# EAGLE design 7seg Display Breakboard_Rev00 (EAGLE 5.11)
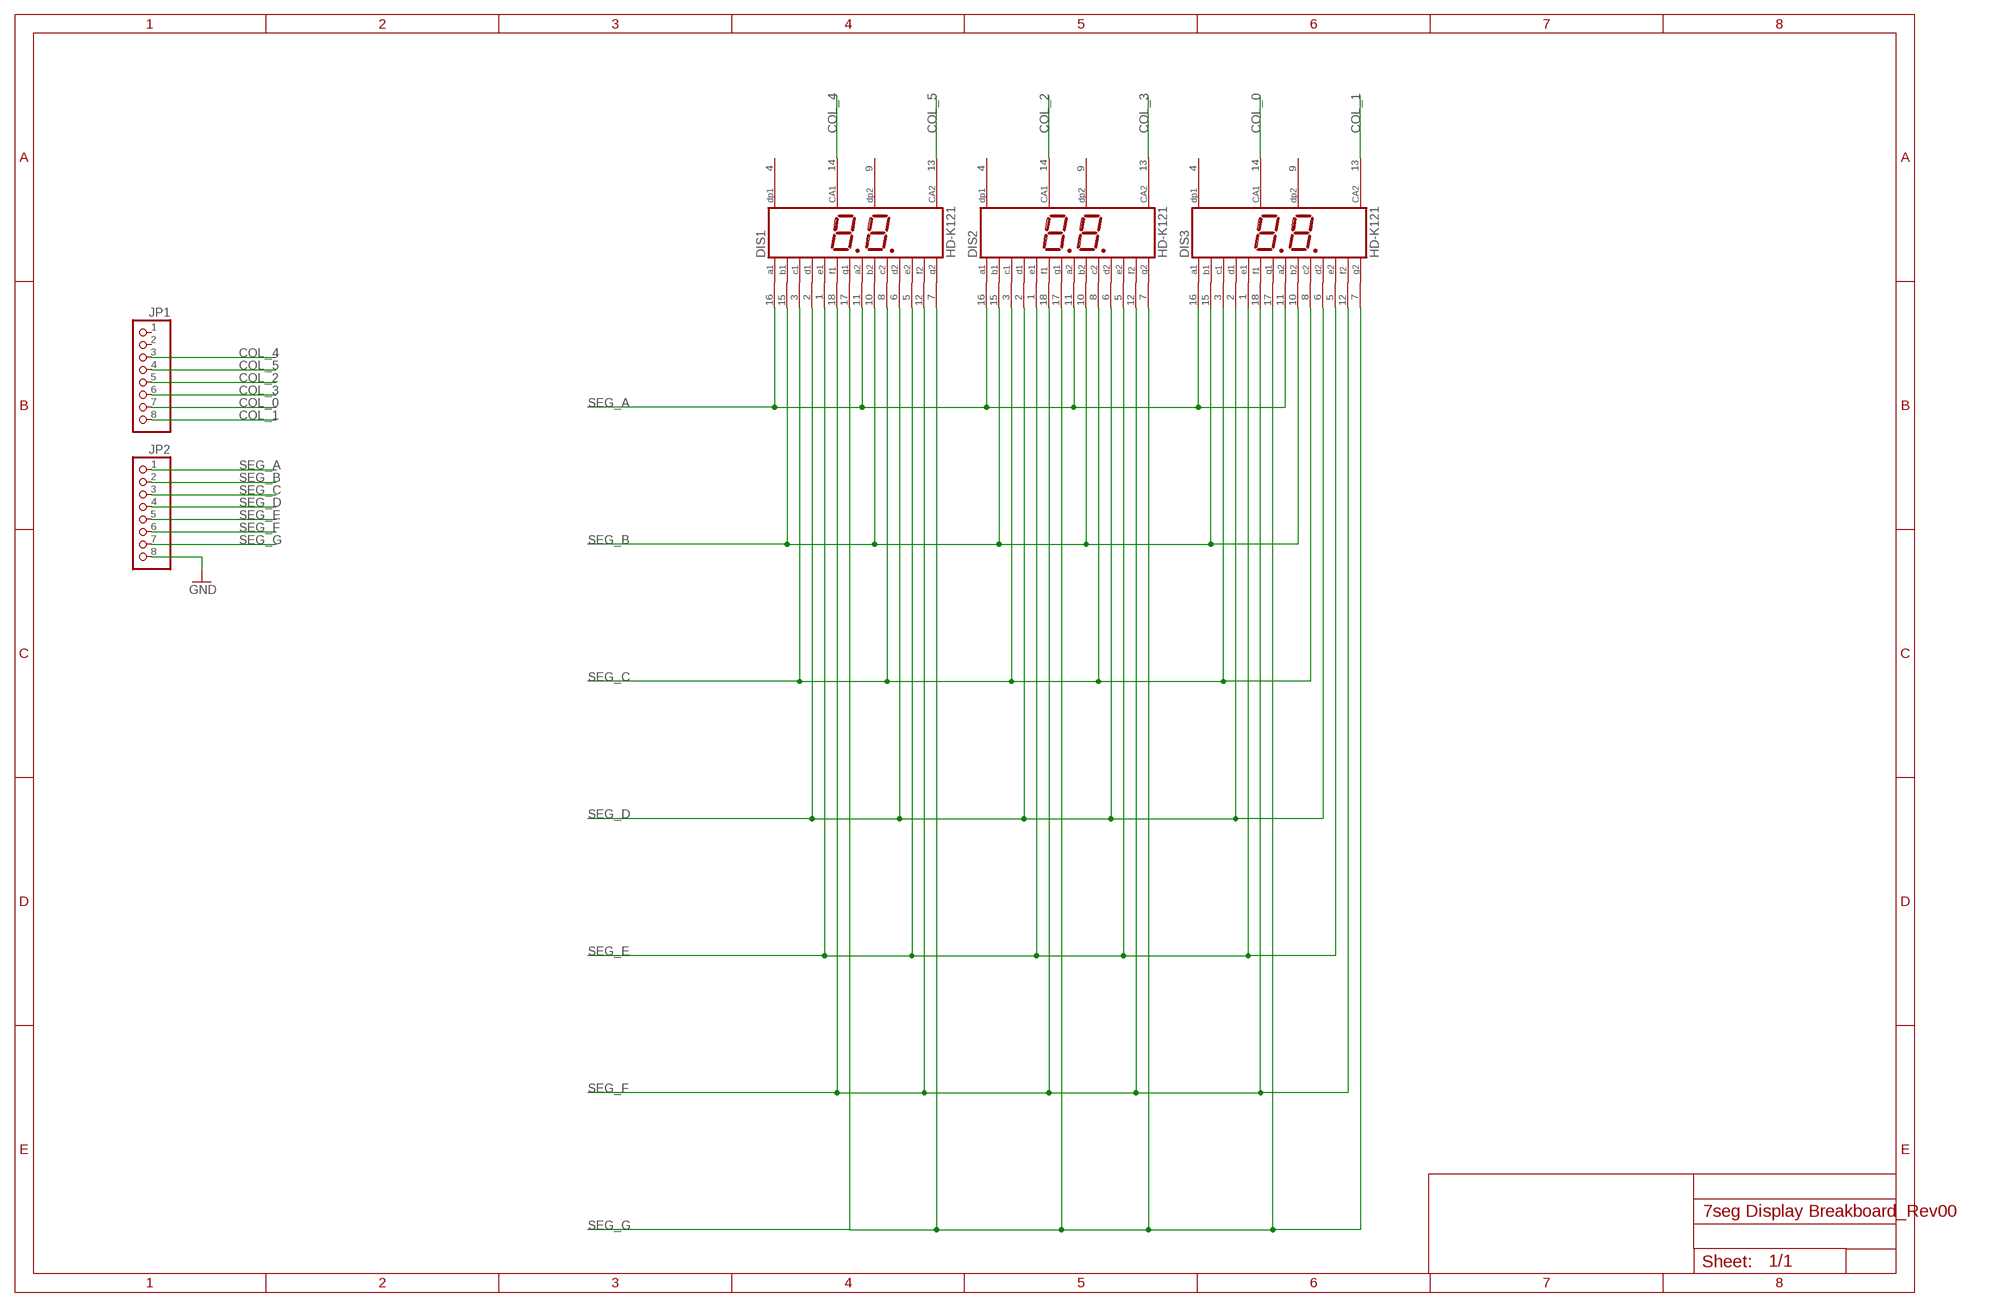
[diagram p0: schematic, sheet 1]

## Parts
DIS1  HD-K121  [HDSP-R]
DIS2  HD-K121  [HDSP-R]
DIS3  HD-K121  [HDSP-R]
JP1  PINHD-1X8/90  [1X08/90]
JP2  PINHD-1X8/90  [1X08/90]

## Nets
COL_0: DIS3.14(CA1) JP1.7
COL_1: DIS3.13(CA2) JP1.8
COL_2: DIS2.14(CA1) JP1.5
COL_3: DIS2.13(CA2) JP1.6
COL_4: DIS1.14(CA1) JP1.3
COL_5: DIS1.13(CA2) JP1.4
GND: JP2.8
SEG_A: DIS1.11(A2) DIS1.16(A1) DIS2.11(A2) DIS2.16(A1) DIS3.11(A2) DIS3.16(A1) JP2.1
SEG_B: DIS1.10(B2) DIS1.15(B1) DIS2.10(B2) DIS2.15(B1) DIS3.10(B2) DIS3.15(B1) JP2.2
SEG_C: DIS1.3(C1) DIS1.8(C2) DIS2.3(C1) DIS2.8(C2) DIS3.3(C1) DIS3.8(C2) JP2.3
SEG_D: DIS1.2(D1) DIS1.6(D2) DIS2.2(D1) DIS2.6(D2) DIS3.2(D1) DIS3.6(D2) JP2.4
SEG_E: DIS1.1(E1) DIS1.5(E2) DIS2.1(E1) DIS2.5(E2) DIS3.1(E1) DIS3.5(E2) JP2.5
SEG_F: DIS1.12(F2) DIS1.18(F1) DIS2.12(F2) DIS2.18(F1) DIS3.12(F2) DIS3.18(F1) JP2.6
SEG_G: DIS1.7(G2) DIS1.17(G1) DIS2.7(G2) DIS2.17(G1) DIS3.7(G2) DIS3.17(G1) JP2.7
Unconnected: DIS1.4(DP1) DIS1.9(DP2) DIS2.4(DP1) DIS2.9(DP2) DIS3.4(DP1) DIS3.9(DP2) JP1.1 JP1.2

## Library data of the parts
DIS1-DIS3 = display-hp:HD-K121: LED DISPLAY 2 x 1 character 7 segment, decimal points right; OC_FARNELL: unknown; OC_NEWARK: unknown
JP1 JP2 = pinhead:PINHD-1X8: PIN HEADER

## Board
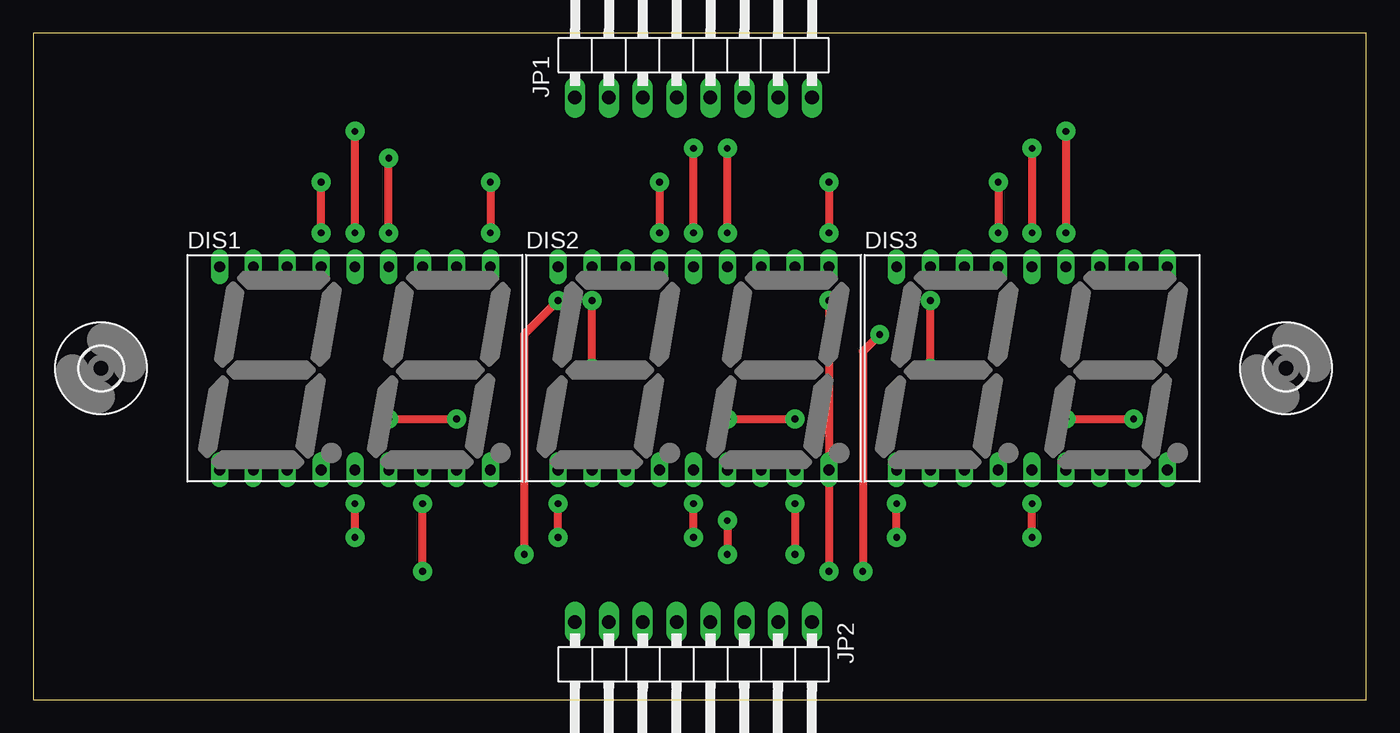
[diagram p1: board, top side]
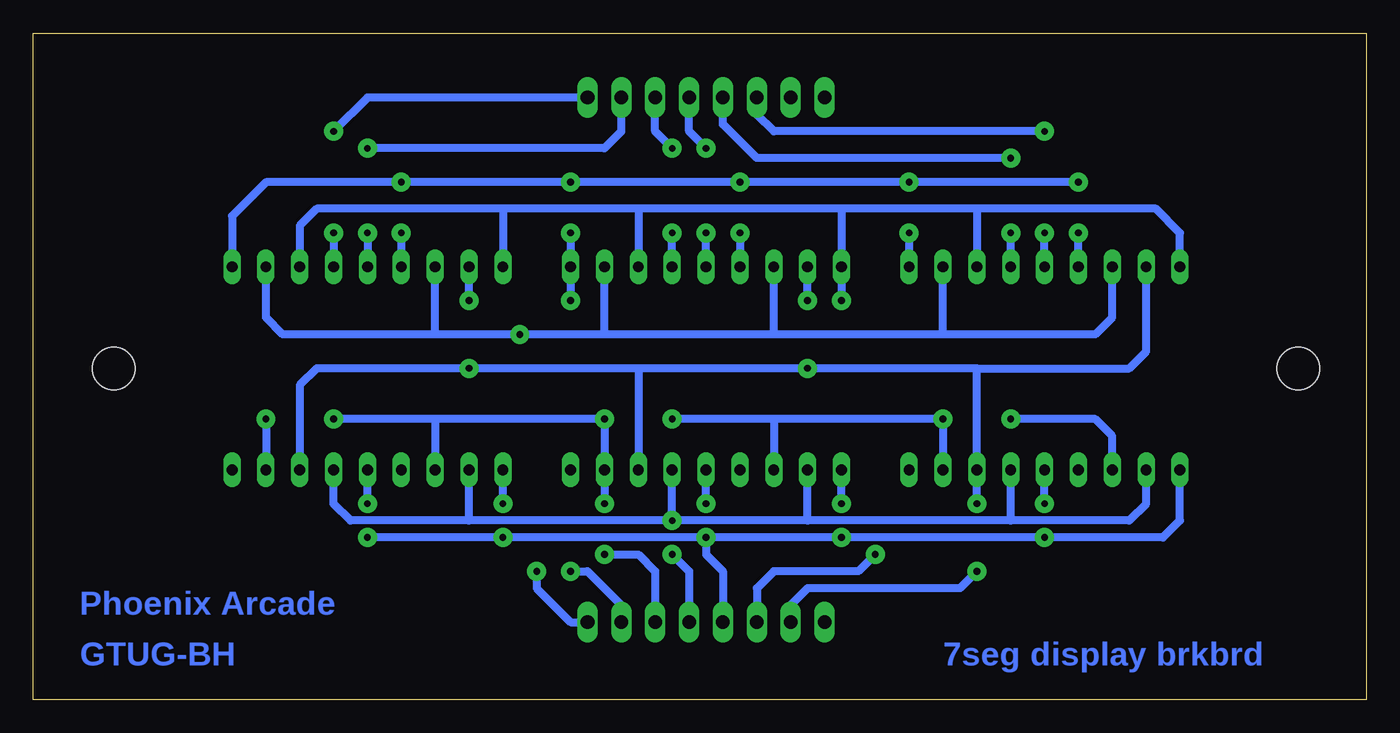
[diagram p2: board, bottom side, seen from below]

Size 100 x 50 mm. Coordinates in mm from the lower left corner, seen from the top.
Outline: 0,0 100,0 100,50 0,50 0,0
Copper layers (1*16): Top 0.035mm / dielectric 1.5mm / Bottom 0.035mm
Design rules "default": minimum track width 10mil, minimum drill 24mil, track to track 8mil, track to pad 8mil, pad to pad 8mil, via to via 8mil, smd to smd 8mil, copper to edge 40mil, drill to drill 8mil, minimum pad ring 10mil, minimum via ring 8mil, stop-mask expansion 4mil, vias tented up to drill 0mil, thermal gap 10mil

### Footprints (pad centres in the part's own frame; a part is rotated, then mirrored left to right if it is on the bottom)
HDSP-R = drill 0.813 long: 1 -10.16,-7.62; 2 -7.62,-7.62; 3 -5.08,-7.62; 4 -2.54,-7.62; 5 0,-7.62; 6 2.54,-7.62; 7 5.08,-7.62; 8 7.62,-7.62; 9 10.16,-7.62; 10 10.16,7.62; 11 7.62,7.62; 12 5.08,7.62; 13 2.54,7.62; 14 0,7.62; 15 -2.54,7.62; 16 -5.08,7.62; 17 -7.62,7.62; 18 -10.16,7.62
1X08/90 = drill 1.016 long: 1 -8.89,-3.81; 2 -6.35,-3.81; 3 -3.81,-3.81; 4 -1.27,-3.81; 5 1.27,-3.81; 6 3.81,-3.81; 7 6.35,-3.81; 8 8.89,-3.81
3,2 = hole 3.2: 0,0

### Placement (x,y rotation side)
DIS1  24.13,24.86 0 top
DIS2  49.53,24.86 0 top
DIS3  74.93,24.86 0 top
JP1  49.53,48.99 0 top
JP2  49.53,2 180 top
U$1  [3,2]  5.08,24.86 0 top
U$2  [3,2]  93.98,24.86 0 top

### Tracks (layer width: path | path; a pad name or v marks a point on that pad's centre or on a via)
COL_0  (via drill 0.51 pad 1.42)
  Top 0.61: v74.93,41.37 v74.93,35.02
  Bottom 0.61: v74.93,35.02 DIS3.14 | v74.93,41.37 57.15,41.37 55.88,42.64 JP1.7
COL_1  (via drill 0.51 pad 1.42)
  Top 0.61: v77.47,42.64 v77.47,35.02
  Bottom 0.61: v77.47,35.02 DIS3.13 | JP1.8 74.93,45.18 v77.47,42.64
COL_2  (via drill 0.51 pad 1.42)
  Top 0.61: v49.53,35.02 v49.53,41.37
  Bottom 0.61: DIS2.14 v49.53,35.02 | v49.53,41.37 50.8,42.64 JP1.5
COL_3  (via drill 0.51 pad 1.42)
  Top 0.61: v52.07,35.02 v52.07,41.37
  Bottom 0.61: DIS2.13 v52.07,35.02 | v52.07,41.37 53.34,42.64 JP1.6
COL_4  (via drill 0.51 pad 1.42)
  Top 0.61: v24.13,35.02 v24.13,42.64
  Bottom 0.61: DIS1.14 v24.13,35.02 | v24.13,42.64 44.45,42.64 45.72,43.91 JP1.3
COL_5  (via drill 0.51 pad 1.42)
  Top 0.61: v26.67,35.02 v26.67,40.64
  Bottom 0.61: DIS1.13 v26.67,35.02 | v26.67,40.64 45.72,40.64 48.26,43.18 JP1.4
SEG_A  (via drill 0.51 pad 1.42)
  Top 0.61: v62.23,9.62 62.23,26.13 v63.5,27.4
  Bottom 0.61: DIS3.11 82.55,28.67 81.28,27.4 69.85,27.4 | 31.75,27.4 20.32,27.4 19.05,28.67 DIS1.16 | 31.75,27.4 44.45,27.4 | 44.45,27.4 57.15,27.4 | 57.15,27.4 v63.5,27.4 69.85,27.4 | 31.75,27.4 DIS1.11 | 44.45,27.4 DIS2.16 | 57.15,27.4 DIS2.11 | 69.85,27.4 DIS3.16 | JP2.1 59.69,5.81 62.23,8.35 v62.23,9.62
SEG_B  (via drill 0.51 pad 1.42)
  Top 0.61: v46.99,38.83 v46.99,35.02 | v72.39,38.83 v72.39,35.02 | v21.59,35.02 v21.59,38.83 | v34.29,38.83 v34.29,35.02 | v59.69,38.83 v59.69,35.02 | v59.69,29.94 v59.69,9.62
  Bottom 0.61: v46.99,35.02 DIS2.15 | DIS3.10 85.09,36.29 82.55,38.83 v72.39,38.83 v59.69,38.83 v46.99,38.83 v34.29,38.83 v21.59,38.83 | v72.39,35.02 DIS3.15 | DIS1.15 v21.59,35.02 | v34.29,35.02 DIS1.10 | v59.69,35.02 DIS2.10 v59.69,29.94 | JP2.2 55.88,7.08 58.42,9.62 v59.69,9.62
SEG_C  (via drill 0.51 pad 1.42)
  Top 0.61: v77.47,21.05 v82.55,21.05 | v52.07,21.05 v57.15,21.05 | v26.67,21.05 v31.75,21.05 | v57.15,14.7 v57.15,10.89
  Bottom 0.61: v82.55,21.05 DIS3.8 | 69.85,21.05 v77.47,21.05 | 69.85,21.05 DIS3.3 | 69.85,21.05 v57.15,21.05 DIS2.8 v57.15,14.7 | 44.45,21.05 v31.75,21.05 DIS1.8 | 44.45,21.05 v52.07,21.05 | v26.67,21.05 20.32,21.05 19.05,19.78 DIS1.3 | 44.45,21.05 DIS2.3 | JP2.3 53.34,9.62 54.61,10.89 v57.15,10.89
SEG_D  (via drill 0.51 pad 1.42)
  Top 0.61: v52.07,13.43 v52.07,10.89
  Bottom 0.61: 67.31,13.43 DIS3.2 | 26.67,13.43 17.78,13.43 16.51,14.7 DIS1.2 | 26.67,13.43 41.91,13.43 | 41.91,13.43 v52.07,13.43 | 26.67,13.43 DIS1.6 | v52.07,13.43 DIS2.6 | JP2.4 50.8,9.62 v52.07,10.89 | v52.07,13.43 67.31,13.43 | 67.31,13.43 76.2,13.43 77.47,14.7 DIS3.6 | 41.91,13.43 DIS2.2
SEG_E  (via drill 0.51 pad 1.42)
  Top 0.61: v74.93,12.16 v74.93,14.7 | v24.13,12.16 v24.13,14.7 | v49.53,12.16 v49.53,14.7 | v64.77,12.16 v64.77,14.7 | v39.37,12.16 v39.37,14.7
  Bottom 0.61: DIS1.1 13.97,13.43 15.24,12.16 v24.13,12.16 v39.37,12.16 v49.53,12.16 | v74.93,14.7 DIS3.5 | v24.13,14.7 DIS1.5 | v49.53,14.7 DIS2.5 | v49.53,12.16 v64.77,12.16 v74.93,12.16 | v64.77,14.7 DIS3.1 | JP2.5 48.26,9.62 49.53,10.89 v49.53,12.16 | v39.37,14.7 DIS2.1
SEG_F  (via drill 0.51 pad 1.42)
  Top 0.61: v36.83,10.89 36.83,27.4 v39.37,29.94
  Bottom 0.61: DIS3.12 80.01,35.56 78.74,36.83 64.77,36.83 | DIS1.18 13.97,35.02 15.78,36.83 29.21,36.83 | v39.37,29.94 DIS2.18 39.37,36.83 | JP2.6 45.72,8.35 44.45,9.62 38.1,9.62 v36.83,10.89 | 29.21,36.83 39.37,36.83 | 39.37,36.83 54.61,36.83 | 54.61,36.83 64.77,36.83 | 29.21,36.83 DIS1.12 | 64.77,36.83 DIS3.18 | 54.61,36.83 DIS2.12
SEG_G  (via drill 0.51 pad 1.42)
  Top 0.61: v67.31,24.86 v67.31,29.94 | v41.91,24.86 v41.91,29.94 | v29.21,9.62 v29.21,14.7
  Bottom 0.61: DIS1.17 16.51,26.13 17.78,24.86 29.21,24.86 | v67.31,29.94 DIS3.17 | 54.61,24.86 v41.91,24.86 29.21,24.86 | 54.61,24.86 v67.31,24.86 78.74,24.86 80.01,23.59 DIS3.7 | v41.91,29.94 DIS2.17 | 29.21,24.86 DIS1.7 v29.21,14.7 | 54.61,24.86 DIS2.7 | JP2.7 43.18,7.08 41.91,8.35 30.48,8.35 v29.21,9.62

### Text on the board
Bottom: Phoenix Arcade | 7seg display brkbrd | GTUG-BH